# EAGLE design busbar (EAGLE 6.5.0)
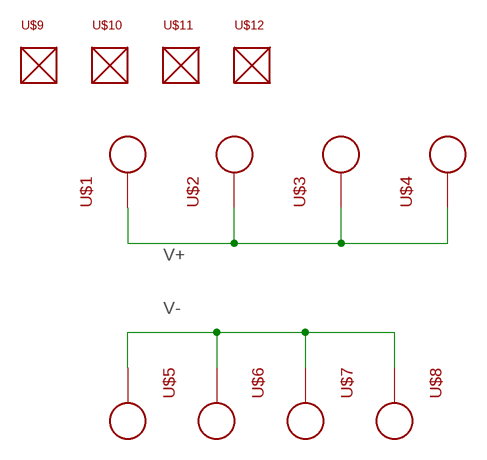
[diagram p0: schematic, sheet 1]

## Parts
U$1  PAD12AWG_PAD  [12AWG_PAD]
U$2  PAD12AWG_PAD  [12AWG_PAD]
U$3  PAD12AWG_PAD  [12AWG_PAD]
U$4  PAD12AWG_PAD  [12AWG_PAD]
U$5  PAD12AWG_PAD  [12AWG_PAD]
U$6  PAD12AWG_PAD  [12AWG_PAD]
U$7  PAD12AWG_PAD  [12AWG_PAD]
U$8  PAD12AWG_PAD  [12AWG_PAD]
U$9  MOUNTM2  [M2MOUNT]
U$10  MOUNTM2  [M2MOUNT]
U$11  MOUNTM2  [M2MOUNT]
U$12  MOUNTM2  [M2MOUNT]

## Nets
V+: U$1.1 U$2.1 U$3.1 U$4.1
V-: U$5.1 U$6.1 U$7.1 U$8.1

## Library data of the parts
U$1-U$8 = busbar:PAD
U$9-U$12 = busbar:MOUNT

## Board
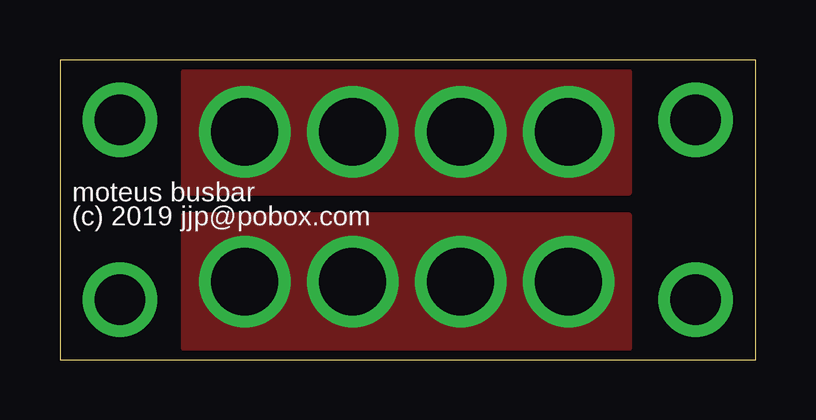
[diagram p1: board, top side]
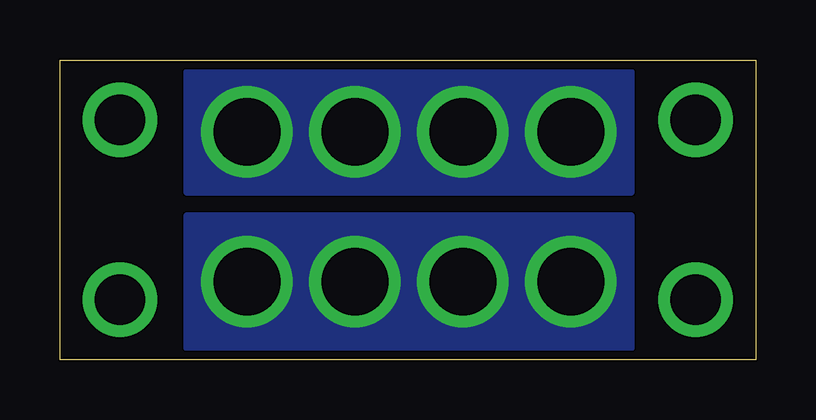
[diagram p2: board, bottom side, seen from below]

Size 29 x 12.5 mm. Coordinates in mm from the lower left corner, seen from the top.
Outline: 0,0 29,0 29,12.5 0,12.5 0,0
Copper layers (1*16): Top 0.035559375mm / dielectric 1.6mm / Bottom 0.035559375mm
Design rules "oshpark-2layer": minimum track width 6mil, minimum drill 10mil, track to track 6mil, track to pad 6mil, pad to pad 6mil, via to via 6mil, smd to smd 6mil, copper to edge 15mil, drill to drill 6mil, minimum pad ring 5mil, minimum via ring 5mil, stop-mask expansion 2.5mil, vias tented up to drill 0mil, thermal gap 10mil

### Footprints (pad centres in the part's own frame; a part is rotated, then mirrored left to right if it is on the bottom)
12AWG_PAD = drill 2.8: 1 0,0
M2MOUNT = drill 2.1: P$1 0,0

### Placement (x,y rotation side)
U$1  12.2,3.25 0 top
U$2  16.7,3.25 0 top
U$3  7.7,3.25 0 top
U$4  21.2,3.25 0 top
U$5  12.2,9.5 0 top
U$6  16.7,9.5 0 top
U$7  7.7,9.5 0 top
U$8  21.2,9.5 0 top
U$9  2.5,10 0 top
U$10  26.5,2.5 0 top
U$11  2.5,2.5 0 top
U$12  26.5,10 0 top

### Tracks (layer width: path | path; a pad name or v marks a point on that pad's centre or on a via)
V+
  pour Bottom: 5.2,6 23.7,6 23.7,0.5 5.2,0.5
  pour Top: 5.2,6 23.7,6 23.7,0.5 5.2,0.5
V-
  pour Top: 5.2,12 23.7,12 23.7,7 5.2,7
  pour Bottom: 5.2,12 23.7,12 23.7,7 5.2,7

### Text on the board
tPlace: moteus busbar | (c) 2019 jjp@pobox.com